# EasyEDA schematic schematicSCH.json
TITLE: Sheet_1; REV: 1.0; Date: 2024-04-22; Sheet: 1/1; Drawn By: angelina.t1832; Company: Your Company
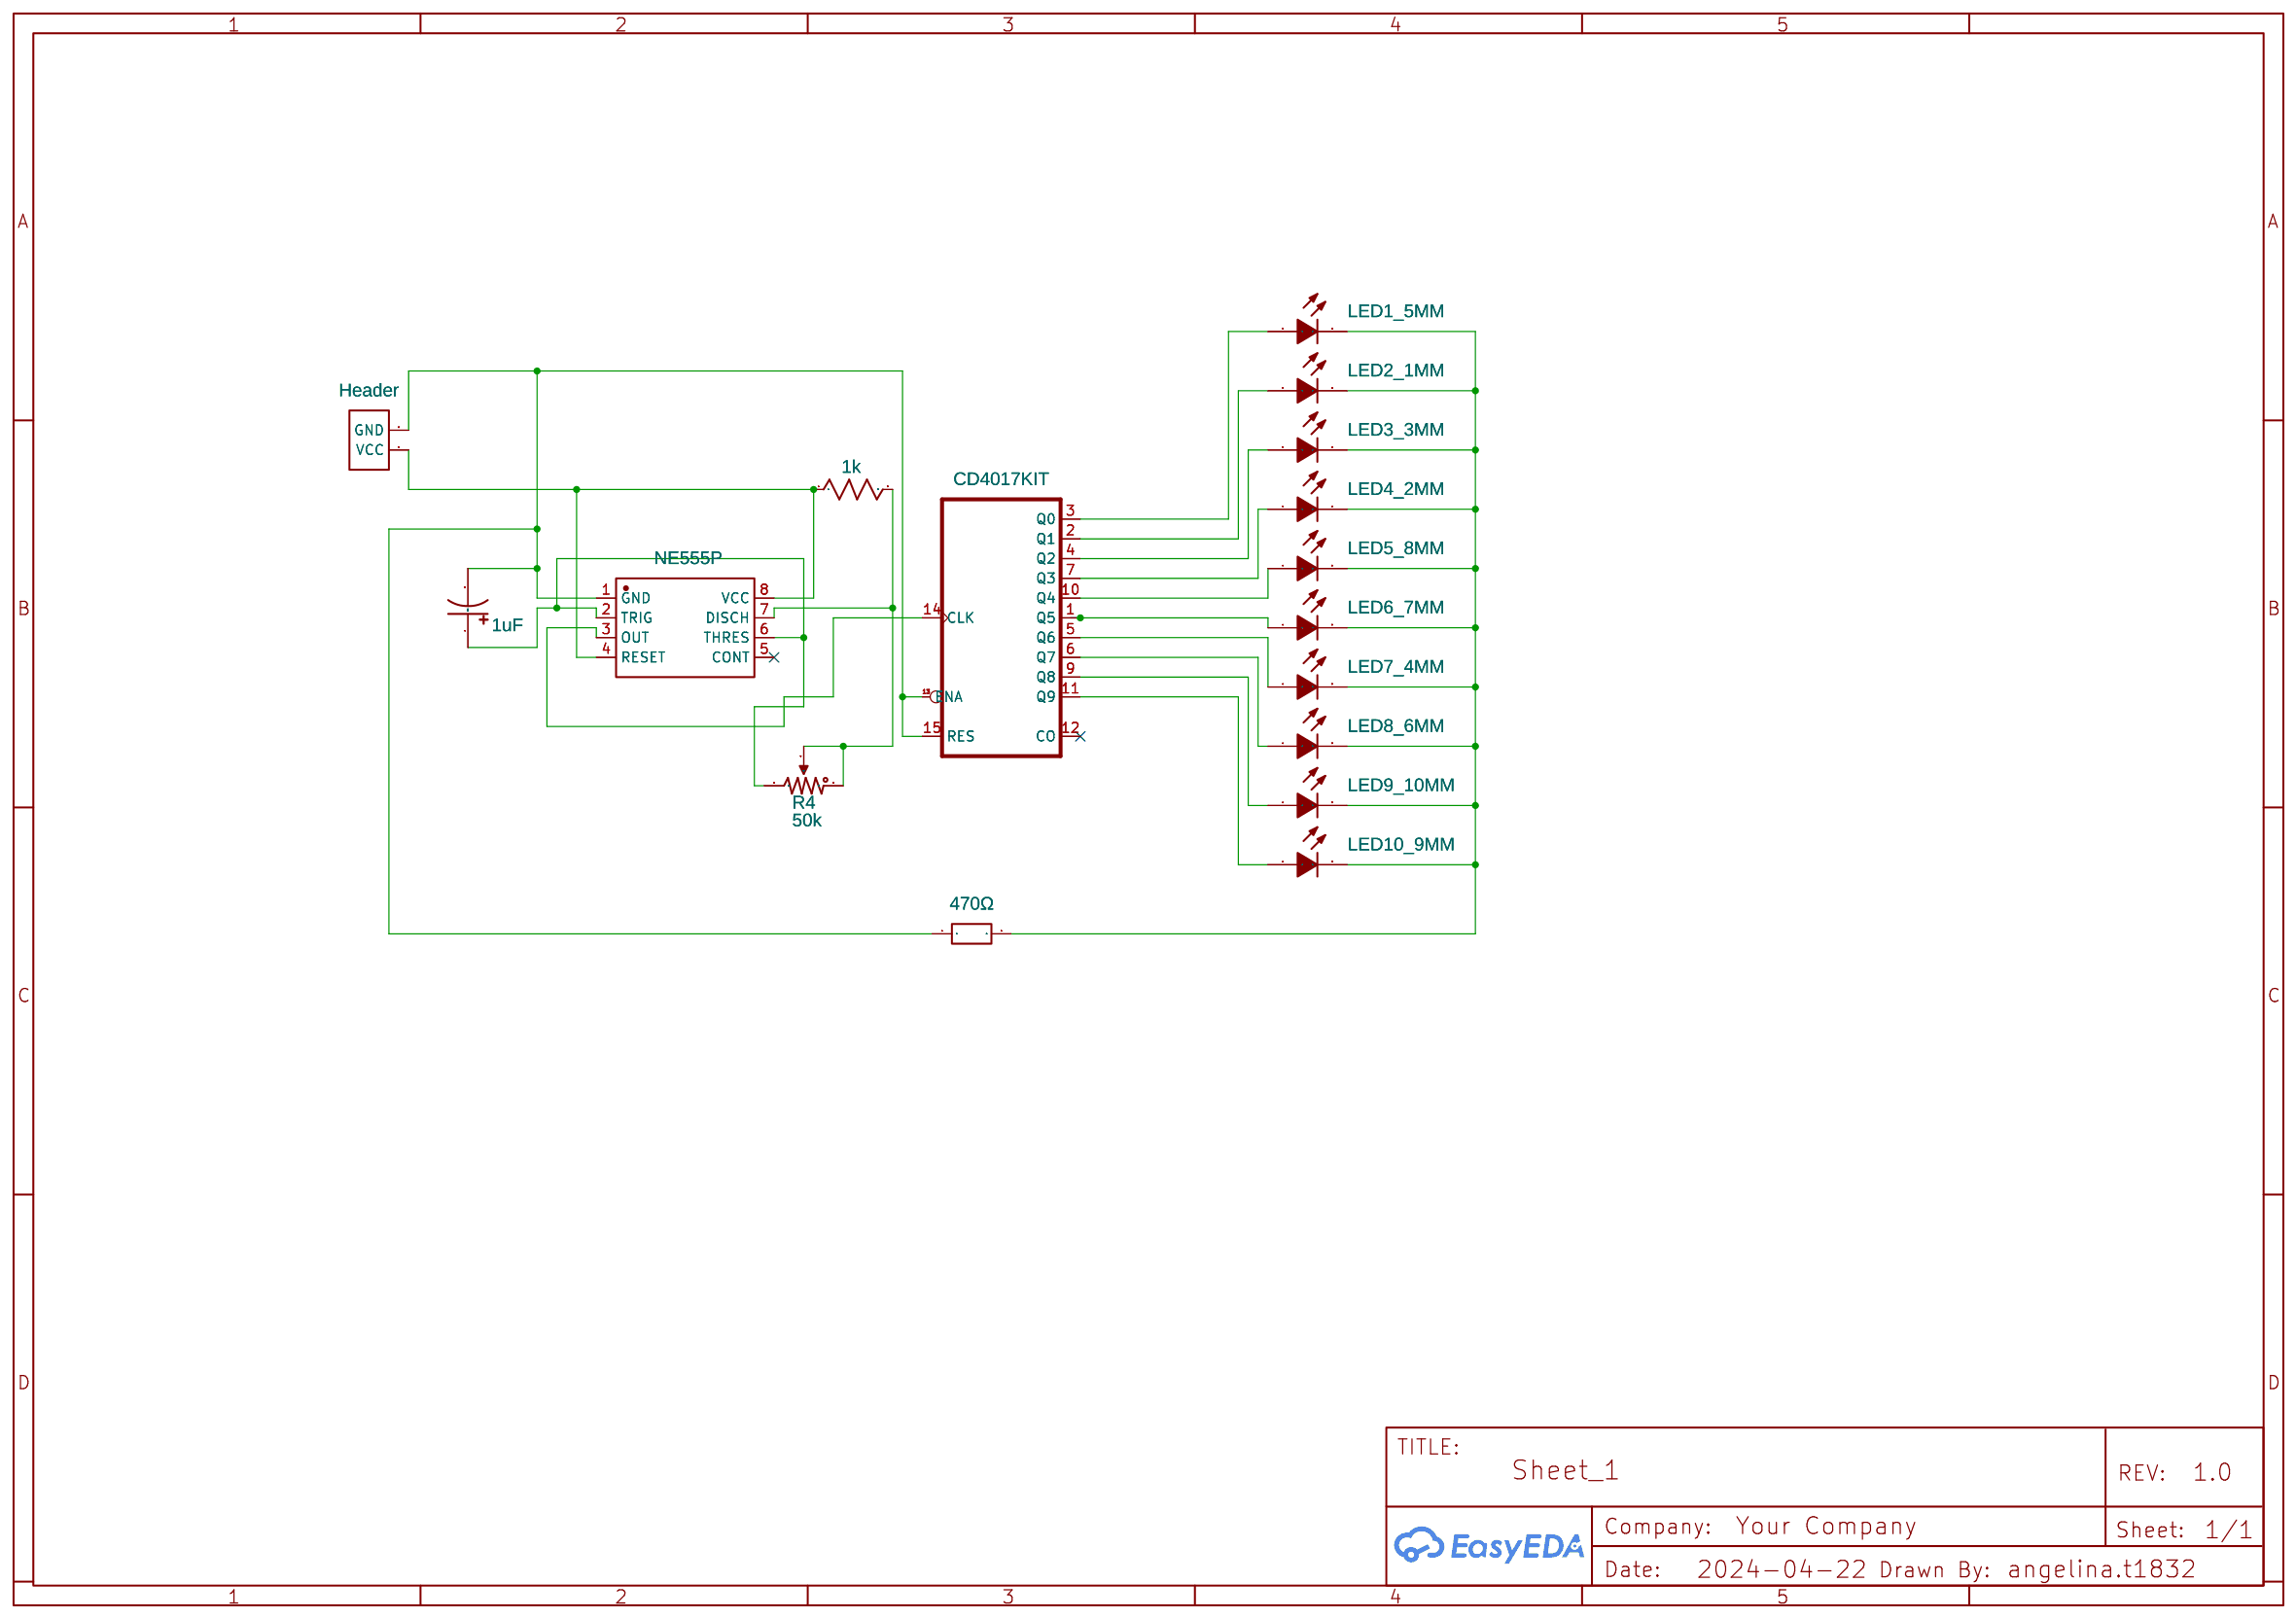
[diagram p0: schematic sheet]

## Parts
C1  1uF  [CAP-TH_BD5.0-P2.00-D0.8-FD]
H1  Header  [HEADER-FEMALE-2.54_1X2]
LED1_5MM  LED_5MM  [LED-TH_BD5.0-P2.54-FD_C9900023552]
LED2_1MM  LED_5MM  [LED-TH_BD5.0-P2.54-FD_C9900023552]
LED3_3MM  LED_5MM  [LED-TH_BD5.0-P2.54-FD_C9900023552]
LED4_2MM  LED_5MM  [LED-TH_BD5.0-P2.54-FD_C9900023552]
LED5_8MM  LED_5MM  [LED-TH_BD5.0-P2.54-FD_C9900023552]
LED6_7MM  LED_5MM  [LED-TH_BD5.0-P2.54-FD_C9900023552]
LED7_4MM  LED_5MM  [LED-TH_BD5.0-P2.54-FD_C9900023552]
LED8_6MM  LED_5MM  [LED-TH_BD5.0-P2.54-FD_C9900023552]
LED9_10MM  LED_5MM  [LED-TH_BD5.0-P2.54-FD_C9900023552]
LED10_9MM  LED_5MM  [LED-TH_BD5.0-P2.54-FD_C9900023552]
R2  1k  [AXIAL-0.3]
R4  50k  [RES-ADJ_3296X]
U1  CD4017KIT  [DIL16-KIT]  (section 1)
U2  NE555P  [DIP-8_L9.8-W6.6-P2.54-LS7.6-BL]
U3  470Ω  [RES-TH_BD3.3-L9.0-P13.00-D0.6]

## Library data of the parts
C1 = UVZ1H010MDD: Contributor: LCSC; Supplier: LCSC; Supplier Part: C433277; Manufacturer: Nichicon(尼吉康)
H1 = HEADER-FEMALE-2.54_1X2: Contributor: nonstop2004
LED1_5MM LED2_1MM LED3_3MM LED4_2MM LED5_8MM LED6_7MM LED7_4MM LED8_6MM LED9_10MM LED10_9MM = LED_5MM: Contributor: lcsc; Supplier: LCSC; Supplier Part: C9900023552; Manufacturer: null; JLCPCB Part Class: Extended Part
R2 = Resistor: Manufacturer Part: ?
R4 = Potentiometer: K(%): 50; Manufacturer Part: ?
U1 = CD4017KIT: Contributor: SparkFun; subpart_no: 1
U2 = NE555P: Supplier: LCSC; Manufacturer: TI(德州仪器); Supplier Part: C46749; JLCPCB Part Class: Extended Part
U3 = RSF-50JT-52-470R: Contributor: lcsc; Supplier: LCSC; Supplier Part: C1377653; Manufacturer: YAGEO(国巨)

## Nets
Net-(C1-1): C1.1 R4.1 U2.2(TRIG) U2.6(THRES)
Net-(C1-2): C1.2 H1.2(GND) U1.13(ENA) U1.15(RES) U2.1(GND) U3.1
Net-(H1-1): H1.1(VCC) R2.1 U2.4(RESET) U2.8(VCC)
Net-(LED1_5MM-1): LED1_5MM.1(A) U1.3(Q0)
Net-(LED1_5MM-2): LED1_5MM.2(K) LED2_1MM.2(K) LED3_3MM.2(K) LED4_2MM.2(K) LED5_8MM.2(K) LED6_7MM.2(K) LED7_4MM.2(K) LED8_6MM.2(K) LED9_10MM.2(K) LED10_9MM.2(K) U3.2
Net-(LED2_1MM-1): LED2_1MM.1(A) U1.2(Q1)
Net-(LED3_3MM-1): LED3_3MM.1(A) U1.4(Q2)
Net-(LED4_2MM-1): LED4_2MM.1(A) U1.7(Q3)
Net-(LED5_8MM-1): LED5_8MM.1(A) U1.10(Q4)
Net-(LED6_7MM-1): LED6_7MM.1(A) U1.1(Q5)
Net-(LED7_4MM-1): LED7_4MM.1(A) U1.5(Q6)
Net-(LED8_6MM-1): LED8_6MM.1(A) U1.6(Q7)
Net-(LED9_10MM-1): LED9_10MM.1(A) U1.9(Q8)
Net-(LED10_9MM-1): LED10_9MM.1(A) U1.11(Q9)
Net-(R2-2): R2.2 R4.2(3) R4.3(2) U2.7(DISCH)
Net-(U1.1-14): U1.14(CLK) U2.3(OUT)

Not connected (* = marked no-connect by the designer): U1 12(CO)*; U2 5(CONT)*
